# Altium schematic sheet main.SchDoc
size A4; SheetNumber: 1; SheetTotal: 1
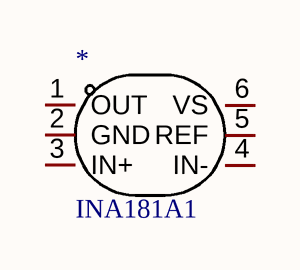
[diagram p0: main.SchDoc]

## Parts
*  INA181A1  [SOT23-6L]

## Nets

Not connected (* = marked no-connect by the designer): * 1(OUT) 2(GND) 3(IN+) 4(IN-) 5(REF) 6(VS)

## Notes on the sheet
- Title:
- A4
- Name:
- Date:
- Author@
- firestaradmin